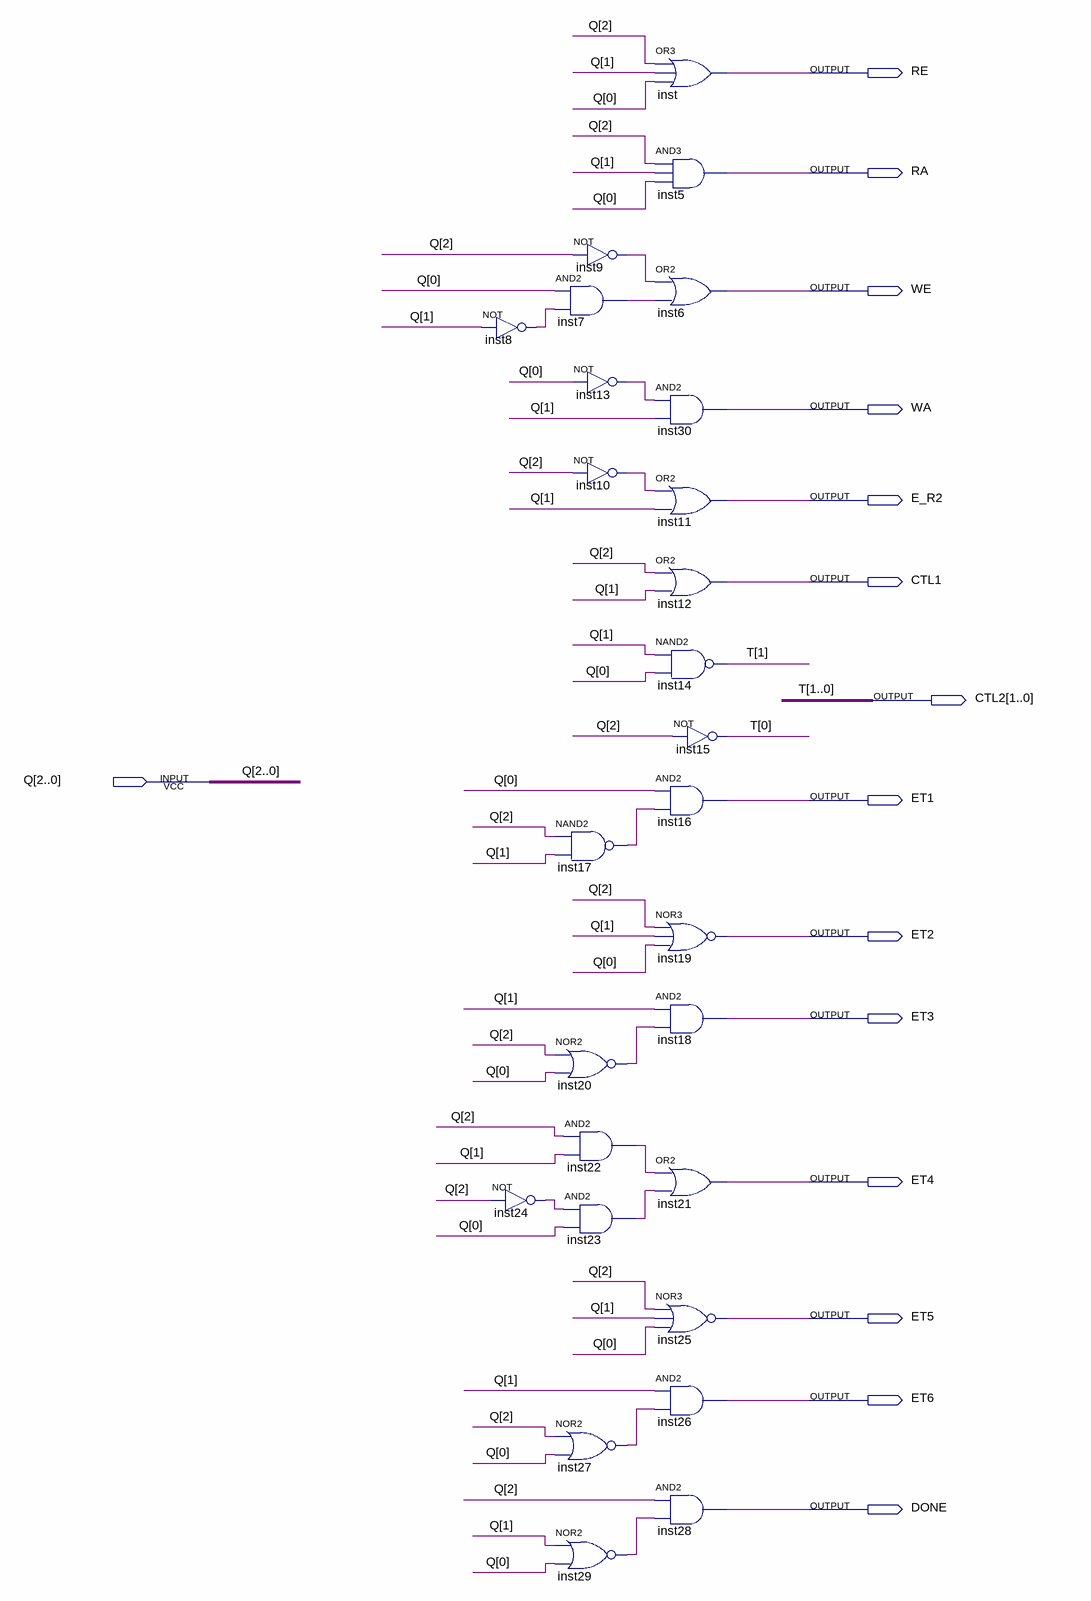
[diagram p0: schematic sheet]
// Quartus schematic OUTPUT.bdf as structural Verilog: 27 symbols, 15 pins
module OUTPUT (
  input  [2:0] Q,
  output RE,
  output RA,
  output WE,
  output WA,
  output E_R2,
  output CTL1,
  output [1:0] CTL2,
  output ET1,
  output ET2,
  output ET3,
  output ET4,
  output ET5,
  output ET6,
  output DONE
);

  wire inst7_out, inst8_out, inst9_out, inst10_out, inst13_out, inst17_out, inst20_out, inst22_out,
       inst23_out, inst24_out, inst27_out, inst29_out;

  not inst8 (inst8_out, Q[1]);
  not inst24 (inst24_out, Q[2]);
  not inst9 (inst9_out, Q[2]);
  and inst7 (inst7_out, Q[0], inst8_out);
  not inst13 (inst13_out, Q[0]);
  not inst10 (inst10_out, Q[2]);
  nand inst17 (inst17_out, Q[2], Q[1]);
  nor inst20 (inst20_out, Q[2], Q[0]);
  and inst22 (inst22_out, Q[2], Q[1]);
  and inst23 (inst23_out, inst24_out, Q[0]);
  nor inst27 (inst27_out, Q[2], Q[0]);
  nor inst29 (inst29_out, Q[1], Q[0]);
  or inst (RE, Q[2], Q[1], Q[0]);
  and inst5 (RA, Q[2], Q[1], Q[0]);
  or inst6 (WE, inst9_out, inst7_out);
  and inst30 (WA, inst13_out, Q[1]);
  or inst11 (E_R2, inst10_out, Q[1]);
  or inst12 (CTL1, Q[2], Q[1]);
  nand inst14 (CTL2[1], Q[1], Q[0]);
  not inst15 (CTL2[0], Q[2]);
  and inst16 (ET1, Q[0], inst17_out);
  nor inst19 (ET2, Q[2], Q[1], Q[0]);
  and inst18 (ET3, Q[1], inst20_out);
  or inst21 (ET4, inst22_out, inst23_out);
  nor inst25 (ET5, Q[2], Q[1], Q[0]);
  and inst26 (ET6, Q[1], inst27_out);
  and inst28 (DONE, Q[2], inst29_out);

  // Other names for the same wires on the sheet: T[1:0] = CTL2
endmodule
